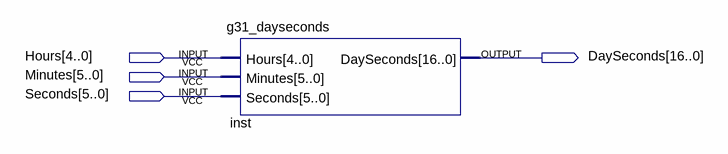
[diagram p0: schematic sheet]
// Quartus schematic g31_lab2.bdf as structural Verilog: 1 symbols, 4 pins
module g31_lab2 (
  input  [4:0] Hours,
  input  [5:0] Minutes,
  input  [5:0] Seconds,
  output [16:0] DaySeconds
);

  g31_dayseconds inst (.Hours(Hours), .Minutes(Minutes), .Seconds(Seconds), .DaySeconds(DaySeconds));
endmodule
